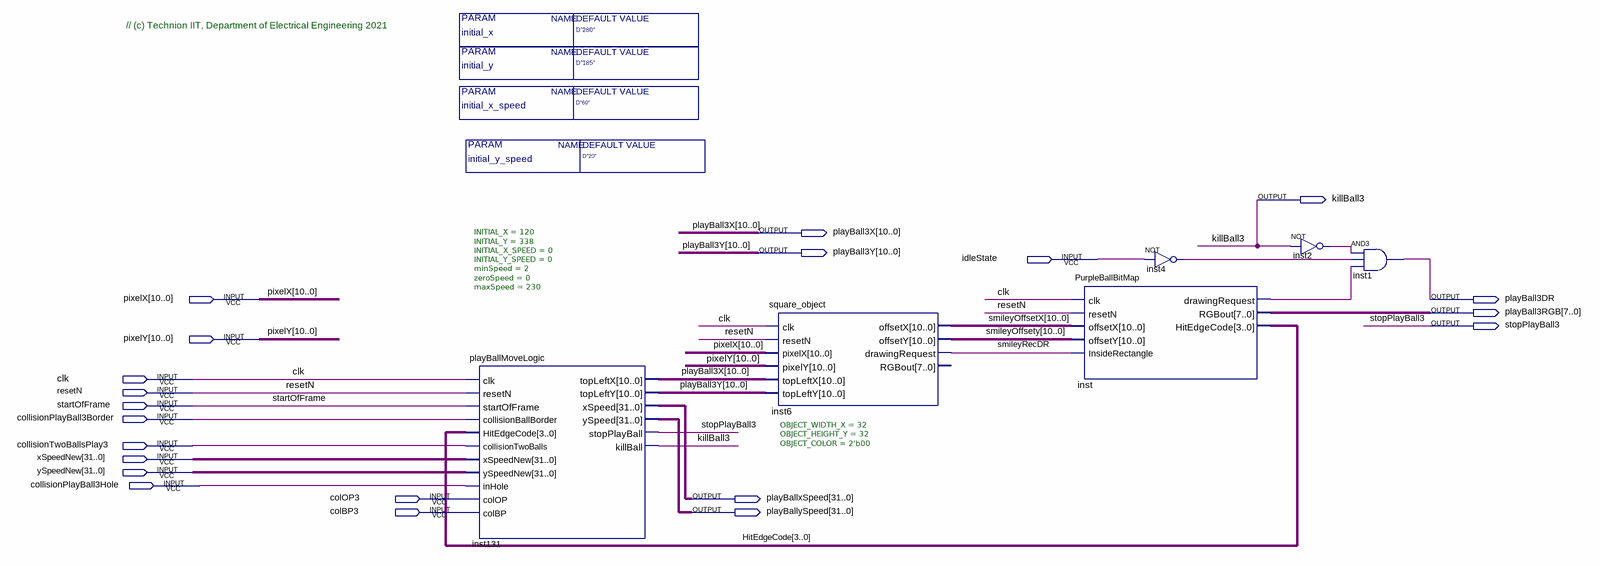
[diagram p0: schematic sheet]
// Quartus schematic playBall3Block.bdf as structural Verilog: 6 symbols, 21 pins
module playBall3Block #(parameter initial_x = "D\"280\"", parameter initial_y = "D\"185\"", parameter initial_x_speed = "D\"60\"", parameter initial_y_speed = "D\"20\"") (
  input  idleState,
  input  [10:0] pixelX,
  input  [10:0] pixelY,
  input  clk,
  input  resetN,
  input  startOfFrame,
  input  collisionPlayBall3Border,
  input  collisionTwoBallsPlay3,
  input  [31:0] xSpeedNew,
  input  [31:0] ySpeedNew,
  input  collisionPlayBall3Hole,
  input  colOP3,
  input  colBP3,
  output killBall3,
  output [10:0] playBall3X,
  output [10:0] playBall3Y,
  output playBall3DR,
  output [7:0] playBall3RGB,
  output stopPlayBall3,
  output [31:0] playBallxSpeed,
  output [31:0] playBallySpeed
);

  wire inst2_out, inst4_out, inst_drawingrequest, smileyRecDR;
  wire [3:0] HitEdgeCode;
  wire [10:0] smileyOffsetX, smileyOffsety;

  playBallMoveLogic #(.INITIAL_X(120), .INITIAL_Y(338), .INITIAL_X_SPEED(0), .INITIAL_Y_SPEED(0), .minSpeed(2), .zeroSpeed(0), .maxSpeed(230)) inst131 (
    .clk(clk), .resetN(resetN), .startOfFrame(startOfFrame), .collisionBallBorder(collisionPlayBall3Border),
    .HitEdgeCode(HitEdgeCode), .collisionTwoBalls(collisionTwoBallsPlay3), .xSpeedNew(xSpeedNew),
    .ySpeedNew(ySpeedNew), .inHole(collisionPlayBall3Hole), .colOP(colOP3), .colBP(colBP3),
    .topLeftX(playBall3X), .topLeftY(playBall3Y), .xSpeed(playBallxSpeed), .ySpeed(playBallySpeed),
    .stopPlayBall(stopPlayBall3), .killBall(killBall3));
  square_object #(.OBJECT_WIDTH_X(32), .OBJECT_HEIGHT_Y(32), .OBJECT_COLOR(2'b00)) inst6 (
    .clk(clk), .resetN(resetN), .pixelX(pixelX), .pixelY(pixelY), .topLeftX(playBall3X),
    .topLeftY(playBall3Y), .offsetX(smileyOffsetX), .offsetY(smileyOffsety), .drawingRequest(smileyRecDR));  // open: RGBout
  PurpleBallBitMap inst (
    .clk(clk), .resetN(resetN), .offsetX(smileyOffsetX), .offsetY(smileyOffsety),
    .InsideRectangle(smileyRecDR), .drawingRequest(inst_drawingrequest), .RGBout(playBall3RGB),
    .HitEdgeCode(HitEdgeCode));
  not inst4 (inst4_out, idleState);
  not inst2 (inst2_out, killBall3);
  and inst1 (playBall3DR, inst2_out, inst4_out, inst_drawingrequest);

  // Notes on the sheet:
  //   // (c) Technion IIT, Department of Electrical Engineering 2021
endmodule
